# EasyEDA Pro project 4090_Portable_Fan.epro, schematic Schematic1
Board Name: 单节电池主板; Create Date: 2025-02-24; Page Name: P1; Project Name: 基于STC8G的风扇控制主板; Schematic Name: Schematic1; Update Date: 2025-12-03; BladeWidth: 10; Company: 嘉立创EDA; Page Size: A4; RegionStart: 1; ShowBorder: 1; TitleBlock: 1; TitleBlockPosition: 3; Version: V1.0; XRegionCount: 6; YRegionCount: 4
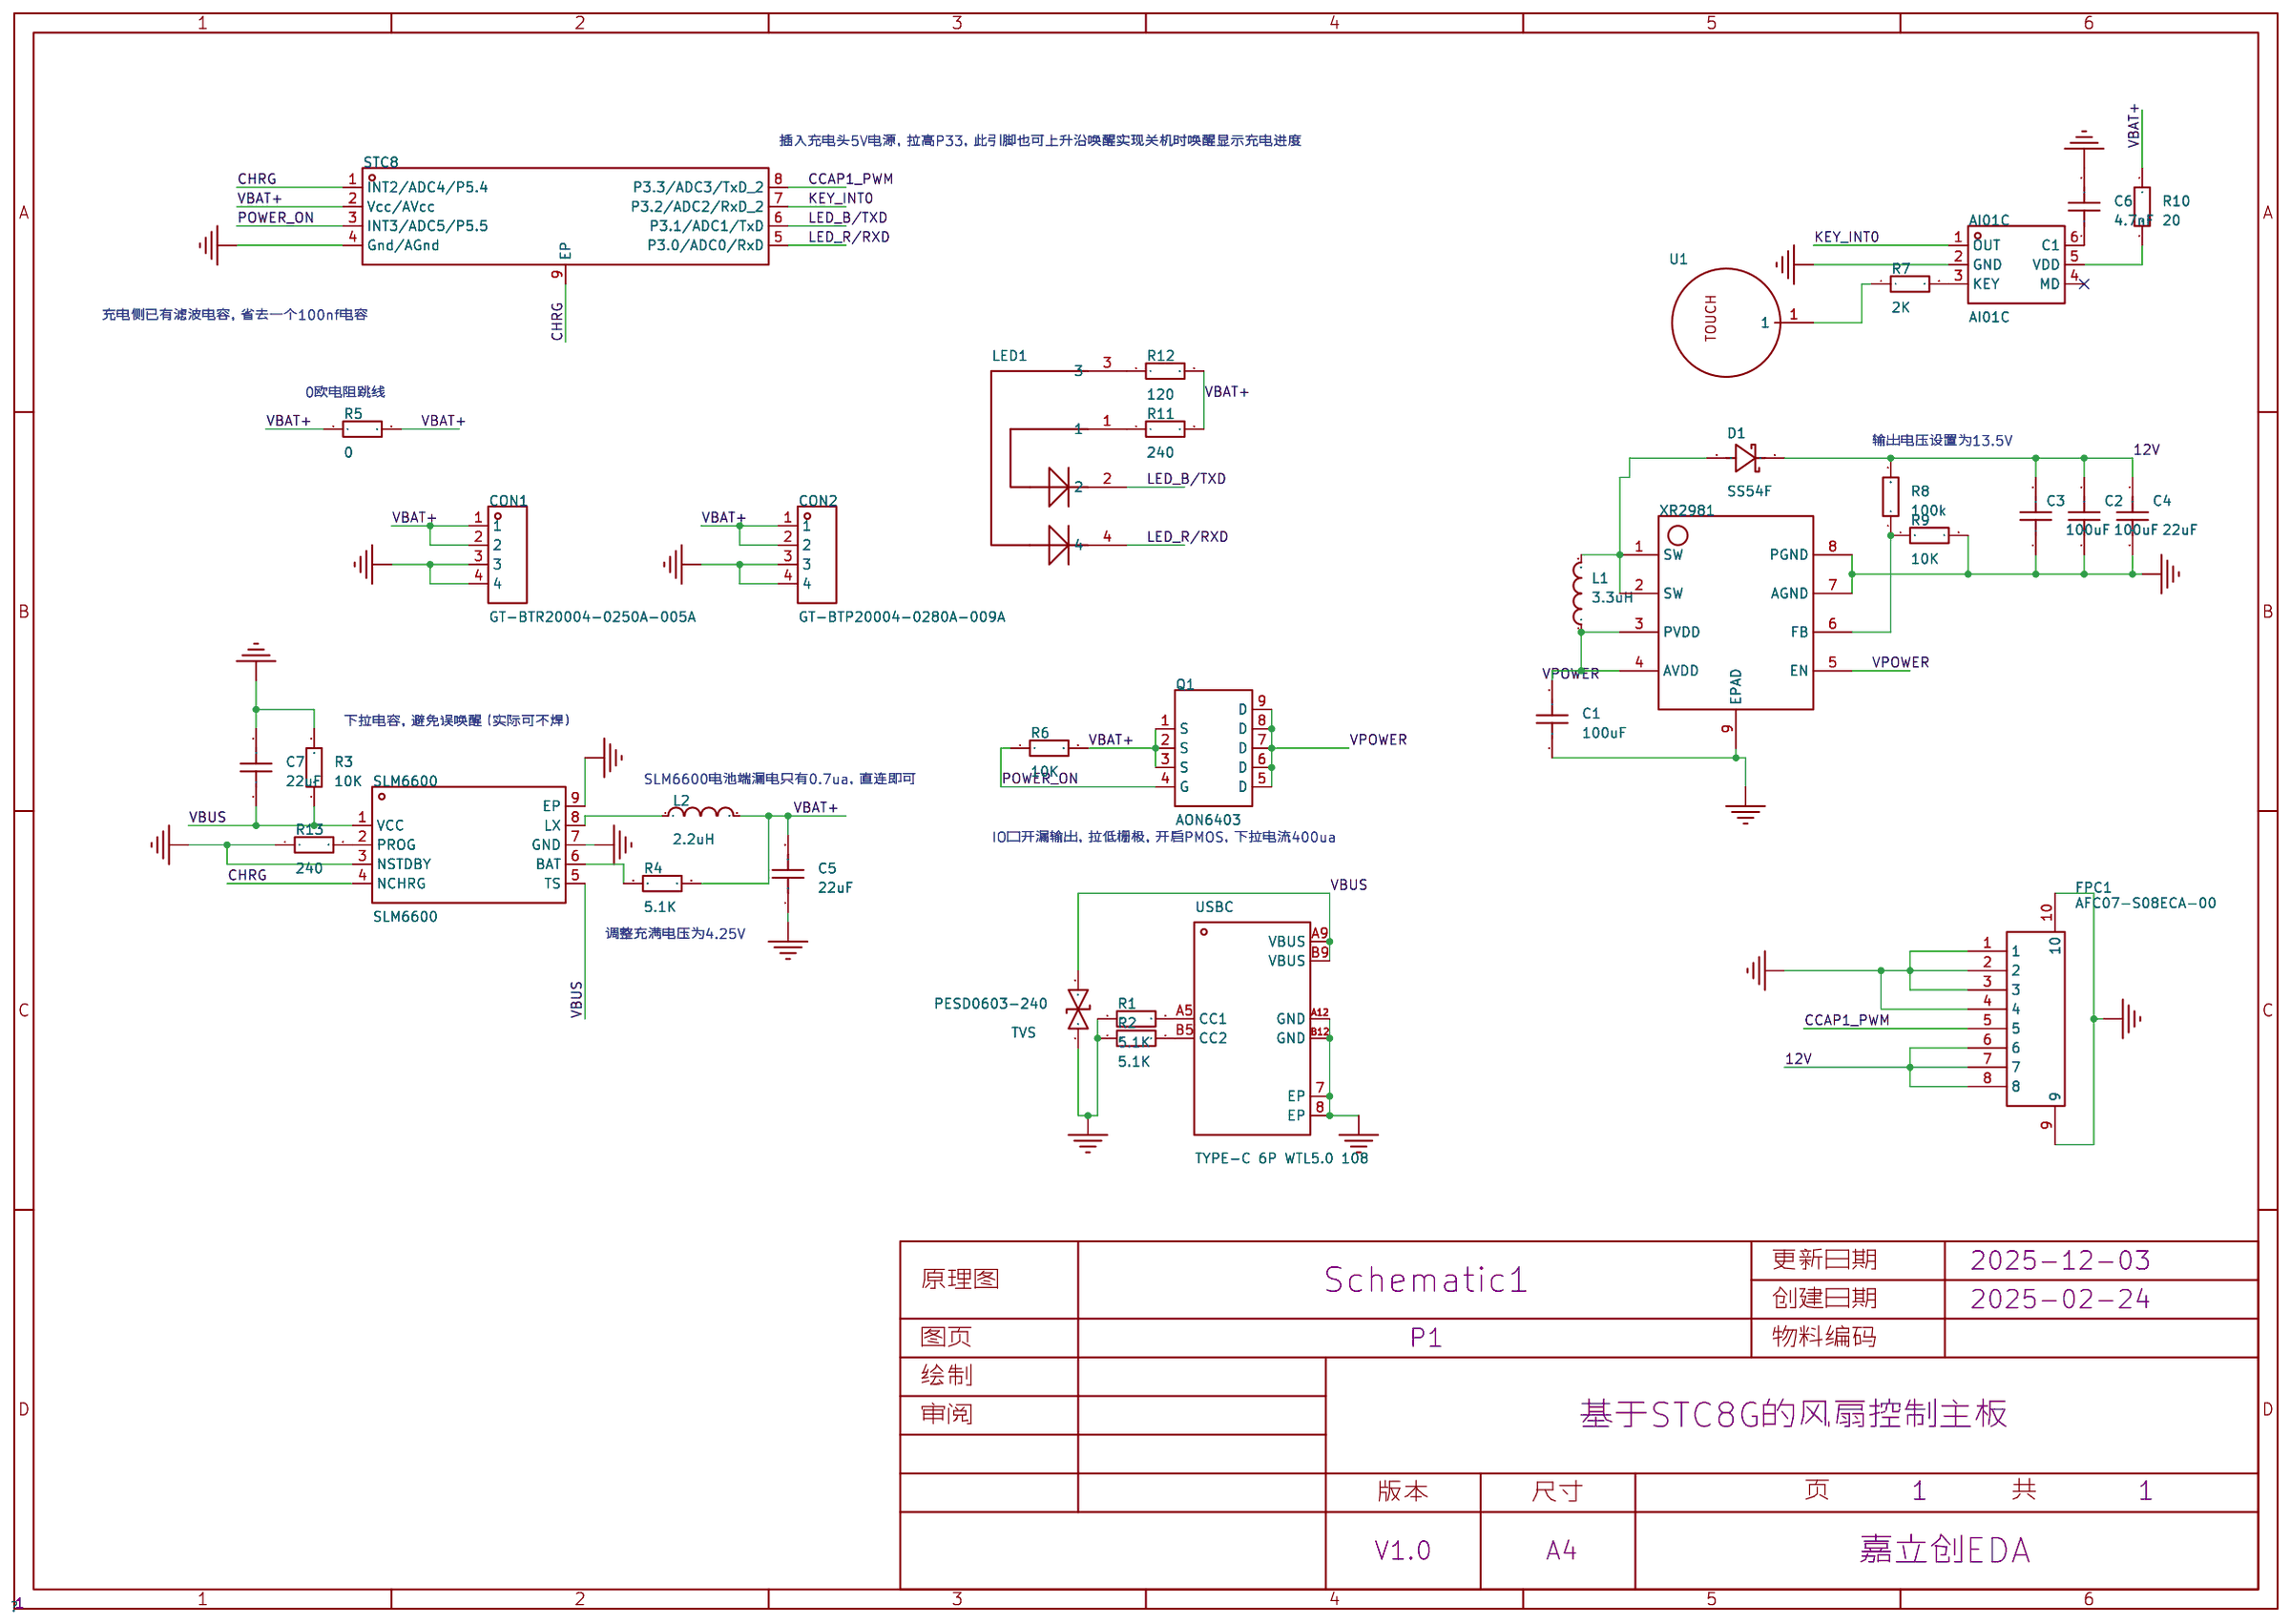
[diagram p3: schematic sheet]

## Parts
AI01C  AI01C  [SOT-23-6_L2.9-W1.6-P0.95-LS2.8-BL]
C1  100uF  [C1210]
C2  100uF  [C1210]
C3  100uF  [C1210]
C4  22uF  [C0805]
C5  22uF  [C0805]
C6  4.7nF  [C0805]
C7  22uF  [C0805]
CON1  GT-BTR20004-0250A-005A  [CONN-SMD_GT-BTR20004-0250A-005A]
CON2  GT-BTP20004-0280A-009A  [CONN-TH_GT-BTP20004-0280A-009A]
D1  SS54F  [SMAF_L3.5-W2.6-LS4.7-RD-1]
FPC1  AFC07-S08ECA-00  [FPC-SMD_P0.5-8P_LCS-SH-H2.0]
L1  3.3uH  [IND-SMD_L8.5-W8.0_ZEMS0850]
L2  2.2uH  [IND-SMD_L7.0-W6.6]
LED1  -  [1206 侧贴双色LED]
Q1  AON6403  [PDFN-8_L5.6-W5.2-P1.27-LS6.1-BL]
R1  5.1K  [R0805]
R2  5.1K  [R0805]
R3  10K  [R0805]
R4  5.1K  [R0805]
R5  0  [R0805]
R6  10K  [R0805]
R7  2K  [R0805]
R8  100k  [R0805]
R9  10K  [R0805]
R10  20  [R0805]
R11  240  [R0805]
R12  120  [R0805]
R13  240  [R0805]
SLM6600  SLM6600  [SOP-8_L4.9-W3.9-P1.27-LS6.0-BL-EP]
STC8  STC8G1K08A-36I-DFN8  [DFN-8_L3.0-W3.0-P0.50-BL-EP]
TVS  PESD0603-240  [D0603-BI]
U1  -  [F9-10-6-0.4喇叭口无针触摸弹簧]
USBC  TYPE-C 6P WTL5.0 108  [USB-C-SMD_TYPE-C-6P-WTL5.0-108]
XR2981  -  [ESOP-8_L4.9-W3.9-P1.27-LS6.0-TL-EP3.3]

## Library data of the parts
AI01C = AI01C: 通道数:1;; LCSC Part Name: 单通道触摸芯片; Supplier Part: C2943977; Manufacturer: Sam&wing(芯网); Supplier Footprint: SOT-23-6L; JLCPCB Part Class: 扩展库; Datasheet: https://atta.szlcsc.com/upload/public/pdf/source/20220822/7FBF328F0E1B91F043D74B98771C088B.pdf; Supplier: LCSC; The Channel Number: 1
C1-C3 = HGC1210R5107M160NSVK: 容值:100uF;精度:±20%;额定电压:16V;温度系数:X5R;; LCSC Part Name: 100uF ±20% 16V; Supplier Part: C7432790; Manufacturer: Chinocera(华瓷); Supplier Footprint: 1210; JLCPCB Part Class: Extended Part; Datasheet: https://item.szlcsc.com/datasheet/HGC1210R5107M160NSVK/8438272.html; Supplier: LCSC; Tolerance: ±20%; Voltage Rating: 16V; Temperature Coefficient: X5R
C4-C7 = CAP_0603: Supplier Footprint: 0603
CON1 = GT-BTR20004-0250A-005A: 刀片电池母座/插接2.0间距/4PIN/塑高2.5/SMT有柱/4A; LCSC Part Name: 卧式Pitch2.0 4P电池母座; Supplier Part: C29780049; Manufacturer: G-Switch(品赞); Supplier Footprint: 插件,P=2mm; JLCPCB Part Class: 扩展库; Datasheet: https://atta.szlcsc.com/upload/public/pdf/source/20240802/6397B66360824D8B1E2E84EB4C77B31A.pdf; Supplier: LCSC; Connect Type: 刀片接触型(母); Pitch: 2mm; Number of Pins: 4P; Mounting Style: 立贴; Current Rating (Max): 4A; Voltage Rating (Max): 20V; Operating Temperature Range: -40℃~+85℃
CON2 = GT-BTP20004-0280A-009A: 刀片电池公座/插接2.0间距/4PIN/塑高2.8/SMT有柱/4A; LCSC Part Name: 立式Pitch2.0 4P电池公座; Supplier Part: C29780051; Manufacturer: G-Switch(品赞); Supplier Footprint: 插件,P=2mm; JLCPCB Part Class: 扩展库; Datasheet: https://atta.szlcsc.com/upload/public/pdf/source/20240802/BAA7DE6A9C3103806FD8D697C86A5FC4.pdf; Supplier: LCSC; Connect Type: 刀片接触型(公); Pitch: 2mm; Number of Pins: 4P; Mounting Style: 立贴; Current Rating (Max): 4A; Voltage Rating (Max): 20V; Contact Material: 磷青铜; Contact Plating: 金; Operating Temperature Range: -40℃~+85℃
D1 = SS54F_C18199179: 二极管配置:独立式;正向压降(Vf):550mV@5.0A;直流反向耐压(Vr):40V;整流电流:5A;; LCSC Part Name: 电压:40V 电流:5A; Supplier Part: C18199179; Manufacturer: 宏嘉诚; Supplier Footprint: SMAF; JLCPCB Part Class: Extended Part; Datasheet: https://atta.szlcsc.com/upload/public/pdf/source/20250121/FDB92513849E10B53DCF948A58635644.pdf; Supplier: LCSC; Diode Configuration: 独立式; Voltage - Forward(Vf@If): 550mV@5.0A; Voltage - DC Reverse(Vr): 40V; Current - Rectified: 5A; Reverse Leakage Current (Ir): 200uA@40V
FPC1 = AFC07-S08ECA-00: 锁定特性:抽屉式;触点类型:上接;触点数量:8P;间距:0.5mm;安装类型:卧贴;; LCSC Part Name: 间距:0.5mm P数:8P 抽屉式 上接; Supplier Part: C262581; Manufacturer: JS(钜硕电子); Supplier Footprint: SMD,P=0.5mm,卧贴; JLCPCB Part Class: Extended Part; Datasheet: https://atta.szlcsc.com/upload/public/pdf/source/20190726/C11082_A2E7B12387019CE4314BB5199EE0FDF4.pdf; Supplier: LCSC; Locking Feature: 抽屉式; Contact Type: 上接; Number of Contacts: 8P; Pitch: 0.5mm; Mounting Type: 卧贴; FFC, FCB Thickness: 0.3mm; Height Above Board: 2mm
L1 = ZEMS0850-150M: 电感值:15uH;精度:±20%;额定电流:5A;饱和电流(Isat):7A;类型:一体成型电感;; Supplier Part: C41413140; Manufacturer: ZE(增益); Supplier Footprint: SMD,8.5x8mm; JLCPCB Part Class: 扩展库; Datasheet: https://atta.szlcsc.com/upload/public/pdf/source/20240923/68F476E1F7C73D76DCA2C5F1052B0A4B.pdf; Supplier: LCSC; Tolerance: ±20%; Current Rating: 5A; Current - Saturation(Isat): 7A; DC Resistance(DCR): 55mΩ; Type: 一体成型电感
L2 = FXL0630-2R2-M: 电感值:2.2uH;精度:±20%;额定电流:9.5A;饱和电流(Isat):10A;类型:一体成型电感;; LCSC Part Name: 2.2uH ±20% 10A; Supplier Part: C167218; Manufacturer: cjiang(长江微电); Supplier Footprint: SMD,6.6x7mm; JLCPCB Part Class: 扩展库; Datasheet: https://atta.szlcsc.com/upload/public/pdf/source/20240426/3189EA8206330E2108542F9E34E540E7.pdf; Supplier: LCSC; Tolerance: ±20%; Rated Current: 9.5A; Saturation Current (Isat): 10A; DC Resistance (DCR): 15mΩ; Type: 一体成型电感
LED1 = 1206侧发光红绿LED
Q1 = AON6403: 数量:1个P沟道;漏源电压(Vdss):30V;连续漏极电流(Id):85A;导通电阻(RDS(on)):3.1mΩ@10V;耗散功率(Pd):-;阈值电压(Vgs(th)):2.2V@250uA;; LCSC Part Name: 1个P沟道 耐压:30V 电流:85A; Supplier Part: C2760089; Manufacturer: AOS; Supplier Footprint: DFN-8(5x6); JLCPCB Part Class: 扩展库; Datasheet: https://atta.szlcsc.com/upload/public/pdf/source/20240417/CECEFA73771F1A601B0FB499439FD37F.pdf; Supplier: LCSC; Number: 1个P沟道; Drain to Source Voltage: 30V; Current - Continuous Drain(Id): 85A; RDS(on): 3.1mΩ@10V; Gate Threshold Voltage (Vgs(th)): 2.2V@250uA; Gate Charge(Qg): 196nC@10V; Input Capacitance(Ciss): 9.12nF@15V; Reverse Transfer Capacitance (Crss@Vds): 1.47nF@15V; Operating Temperature: -55℃~+150℃
R1-R13 = Res_0603: Supplier Footprint: 0603
SLM6600 = SLM6600: 工作电压:4V~6V;最大充电电流:3.5A;电池类型:锂离子/聚合物;电池节数:1;; Supplier Part: C130316; Manufacturer: 无锡松朗微; Supplier Footprint: SOP-8-EP; JLCPCB Part Class: 扩展库; Datasheet: https://atta.szlcsc.com/upload/public/pdf/source/20200723/C130316_33CFDDBAEF8892C90734B89DFA84F834.pdf; Supplier: LCSC; The Chip Type: 降压充电芯片; Supply Voltage: 4V~6V; Maximum Charge Current: 3.5A; Charging Saturation Voltage: 4.2V; Type of Battery: 锂离子/聚合物; Number of Cells: 1; Operating Temperature: -40℃~+85℃
STC8 = STC8G1K08A-36I-DFN8: CPU内核:51系列;应用领域:-;; Supplier Part: C915664; Manufacturer: STC; Supplier Footprint: DFN-8-EP(3x3); JLCPCB Part Class: 扩展库; Datasheet: https://atta.szlcsc.com/upload/public/pdf/source/20241226/1556D7EB67C0BC8C1661C3E278549CA4.pdf; Supplier: LCSC; CPU Core: 51系列; Program Storage Size: 8KB; Program Memory Type: FLASH
TVS = PESD0603-240_C2929617: 钳位电压:45V;击穿电压:-;; Supplier Part: C2929617; Manufacturer: Littelfuse(美国力特); Supplier Footprint: 0603; JLCPCB Part Class: 扩展库; Datasheet: https://atta.szlcsc.com/upload/public/pdf/source/20180516/C207186_7CE2F9DCABF8CE4AA3105E54FFDB24F6.pdf; Supplier: LCSC; Clamping Voltage: 45V; Number of Channels: 单路; Type: ESD
U1 = F9-10-6-0.4喇叭口无针触摸弹簧
USBC = TYPE-C 6P WTL5.0 108: 连接器类型:Type-C;公母:母;安装方式:卧贴;触点数量:6P;端口数量:1;额定电流 - 电源:3A;工作温度范围:-20℃~+85℃;; LCSC Part Name: Type-C 母 卧贴; Supplier Part: C30167323; Manufacturer: SHOU HAN(首韩); Supplier Footprint: SMD; JLCPCB Part Class: 扩展库; Datasheet: https://atta.szlcsc.com/upload/public/pdf/source/20240719/5FA0E35FE16D69FE6470A929035FA38A.pdf; Supplier: LCSC; Connector Type: Type-C; Gender: 母; Mounting Style: 卧贴; Number of Contacts: 6P; Number of Ports: 1; Current Rating - Power (Max): 3A; Rated Voltage (Max): 5V; Connect-Disconnect Life: 5千次; Length: 5mm; Core Colour: 黑色; Operating Temperature Range: -20℃~+85℃
XR2981 = XR2981: ESOP8，输入12A，功率24W，升压ic

## Nets
12V: C2.2 C3.2 C4.1 D1.1(K) FPC1.6 FPC1.7 FPC1.8 R8.2
GND: AI01C.2(GND) C1.2 C2.1 C3.1 C4.2 C5.1 C6.2 C7.2 CON1.3 CON1.4 CON2.3 CON2.4 FPC1.1 FPC1.2 FPC1.3 FPC1.4 FPC1.9 FPC1.10 R1.1 R2.1 R3.2 R9.2 R13.1 SLM6600.3(NSTDBY) SLM6600.7(GND) SLM6600.9(EP) STC8.4(Gnd/AGnd) TVS.1 USBC.7(EP) USBC.8(EP) USBC.A12(GND) USBC.B12(GND) XR2981.7(AGND) XR2981.8(PGND) XR2981.9(EPAD)
VBAT+: C5.2 CON1.1 CON1.2 CON2.1 CON2.2 L2.2 Q1.1(S) Q1.2(S) Q1.3(S) R4.2 R5.1 R5.2 R6.2 R10.1 R11.2 R12.2 STC8.2(Vcc/AVcc)
VBUS: C7.1 R3.1 SLM6600.1(VCC) SLM6600.5(TS) TVS.2 USBC.A9(VBUS) USBC.B9(VBUS)
CCAP1_PWM: FPC1.5 STC8.8(P3.3/ADC3/TxD_2)
CHRG: SLM6600.4(NCHRG) STC8.1(INT2/ADC4/P5.4) STC8.9(EP)
KEY_INT0: AI01C.1(OUT) STC8.7(P3.2/ADC2/RxD_2)
LED_B/TXD: LED1.2 STC8.6(P3.1/ADC1/TxD)
LED_R/RXD: LED1.4 STC8.5(P3.0/ADC0/RxD)
POWER_ON: Q1.4(G) R6.1 STC8.3(INT3/ADC5/P5.5)
VPOWER: C1.1 L1.1 Q1.5(D) Q1.6(D) Q1.7(D) Q1.8(D) Q1.9(D) XR2981.3(PVDD) XR2981.4(AVDD) XR2981.5(EN)
$1N5842: R13.2 SLM6600.2(PROG)
$1N6415: L2.1 SLM6600.8(LX)
$1N6613: R4.1 SLM6600.6(BAT)
$1N7442: D1.2(A) L1.2 XR2981.1(SW) XR2981.2(SW)
$1N19622: R1.2 USBC.A5(CC1)
$1N19624: R2.2 USBC.B5(CC2)
$1N22290: AI01C.5(VDD) R10.2
$1N22317: AI01C.6(C1) C6.1
$1N22423: AI01C.3(KEY) R7.2
$1N34298: R8.1 R9.1 XR2981.6(FB)
$1N36245: R7.1 U1.1
$1N43070: LED1.3 R12.1
$1N43072: LED1.1 R11.1

Not connected (* = marked no-connect by the designer): AI01C 4(MD)*

## Notes on the sheet
- 插入充电头5V电源，拉高P33，此引脚也可上升沿唤醒实现关机时唤醒显示充电进度
- 充电侧已有滤波电容，省去一个100nf电容
- 0欧电阻跳线
- 输出电压设置为13.5V
- 下拉电容，避免误唤醒（实际可不焊）
- SLM6600电池端漏电只有0.7ua，直连即可
- IO口开漏输出，拉低栅极，开启PMOS，下拉电流400ua
- 调整充满电压为4.25V
